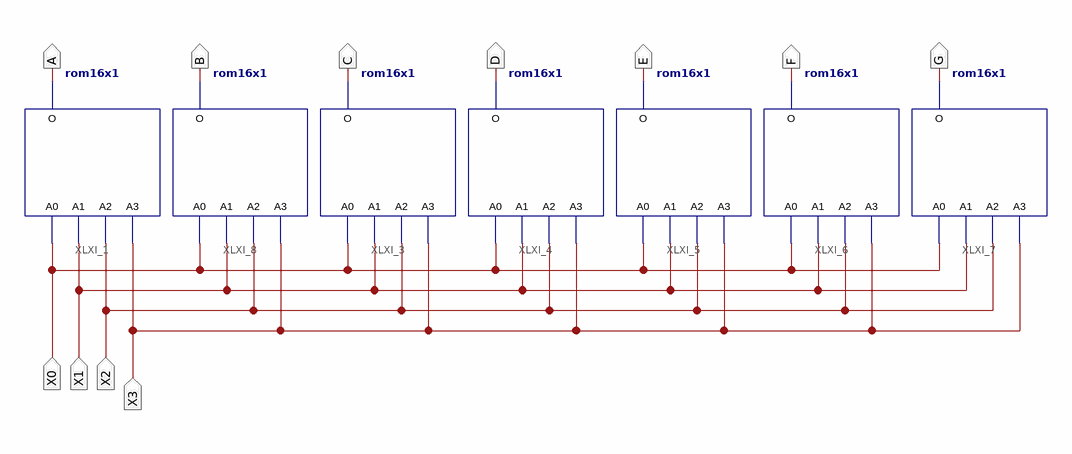
[diagram p0: schematic sheet 1]
// Xilinx ISE schematic LUT.sch (spartan3e) as structural Verilog: 7 symbols, 11 ports
module LUT (
  input  X0,
  input  X1,
  input  X2,
  input  X3,
  output A,
  output C,
  output D,
  output E,
  output F,
  output G,
  output B
);

  rom16x1 #(.INIT("2812")) XLXI_1 (.A0(X0), .A1(X1), .A2(X2), .A3(X3), .O(A));
  rom16x1 #(.INIT("D004")) XLXI_3 (.A0(X0), .A1(X1), .A2(X2), .A3(X3), .O(C));
  rom16x1 #(.INIT("8492")) XLXI_4 (.A0(X0), .A1(X1), .A2(X2), .A3(X3), .O(D));
  rom16x1 #(.INIT("02BA")) XLXI_5 (.A0(X0), .A1(X1), .A2(X2), .A3(X3), .O(E));
  rom16x1 #(.INIT("208E")) XLXI_6 (.A0(X0), .A1(X1), .A2(X2), .A3(X3), .O(F));
  rom16x1 #(.INIT("1083")) XLXI_7 (.A0(X0), .A1(X1), .A2(X2), .A3(X3), .O(G));
  rom16x1 #(.INIT("D860")) XLXI_8 (.A0(X0), .A1(X1), .A2(X2), .A3(X3), .O(B));
endmodule
